# EAGLE design ttag (EAGLE 9.6.2)
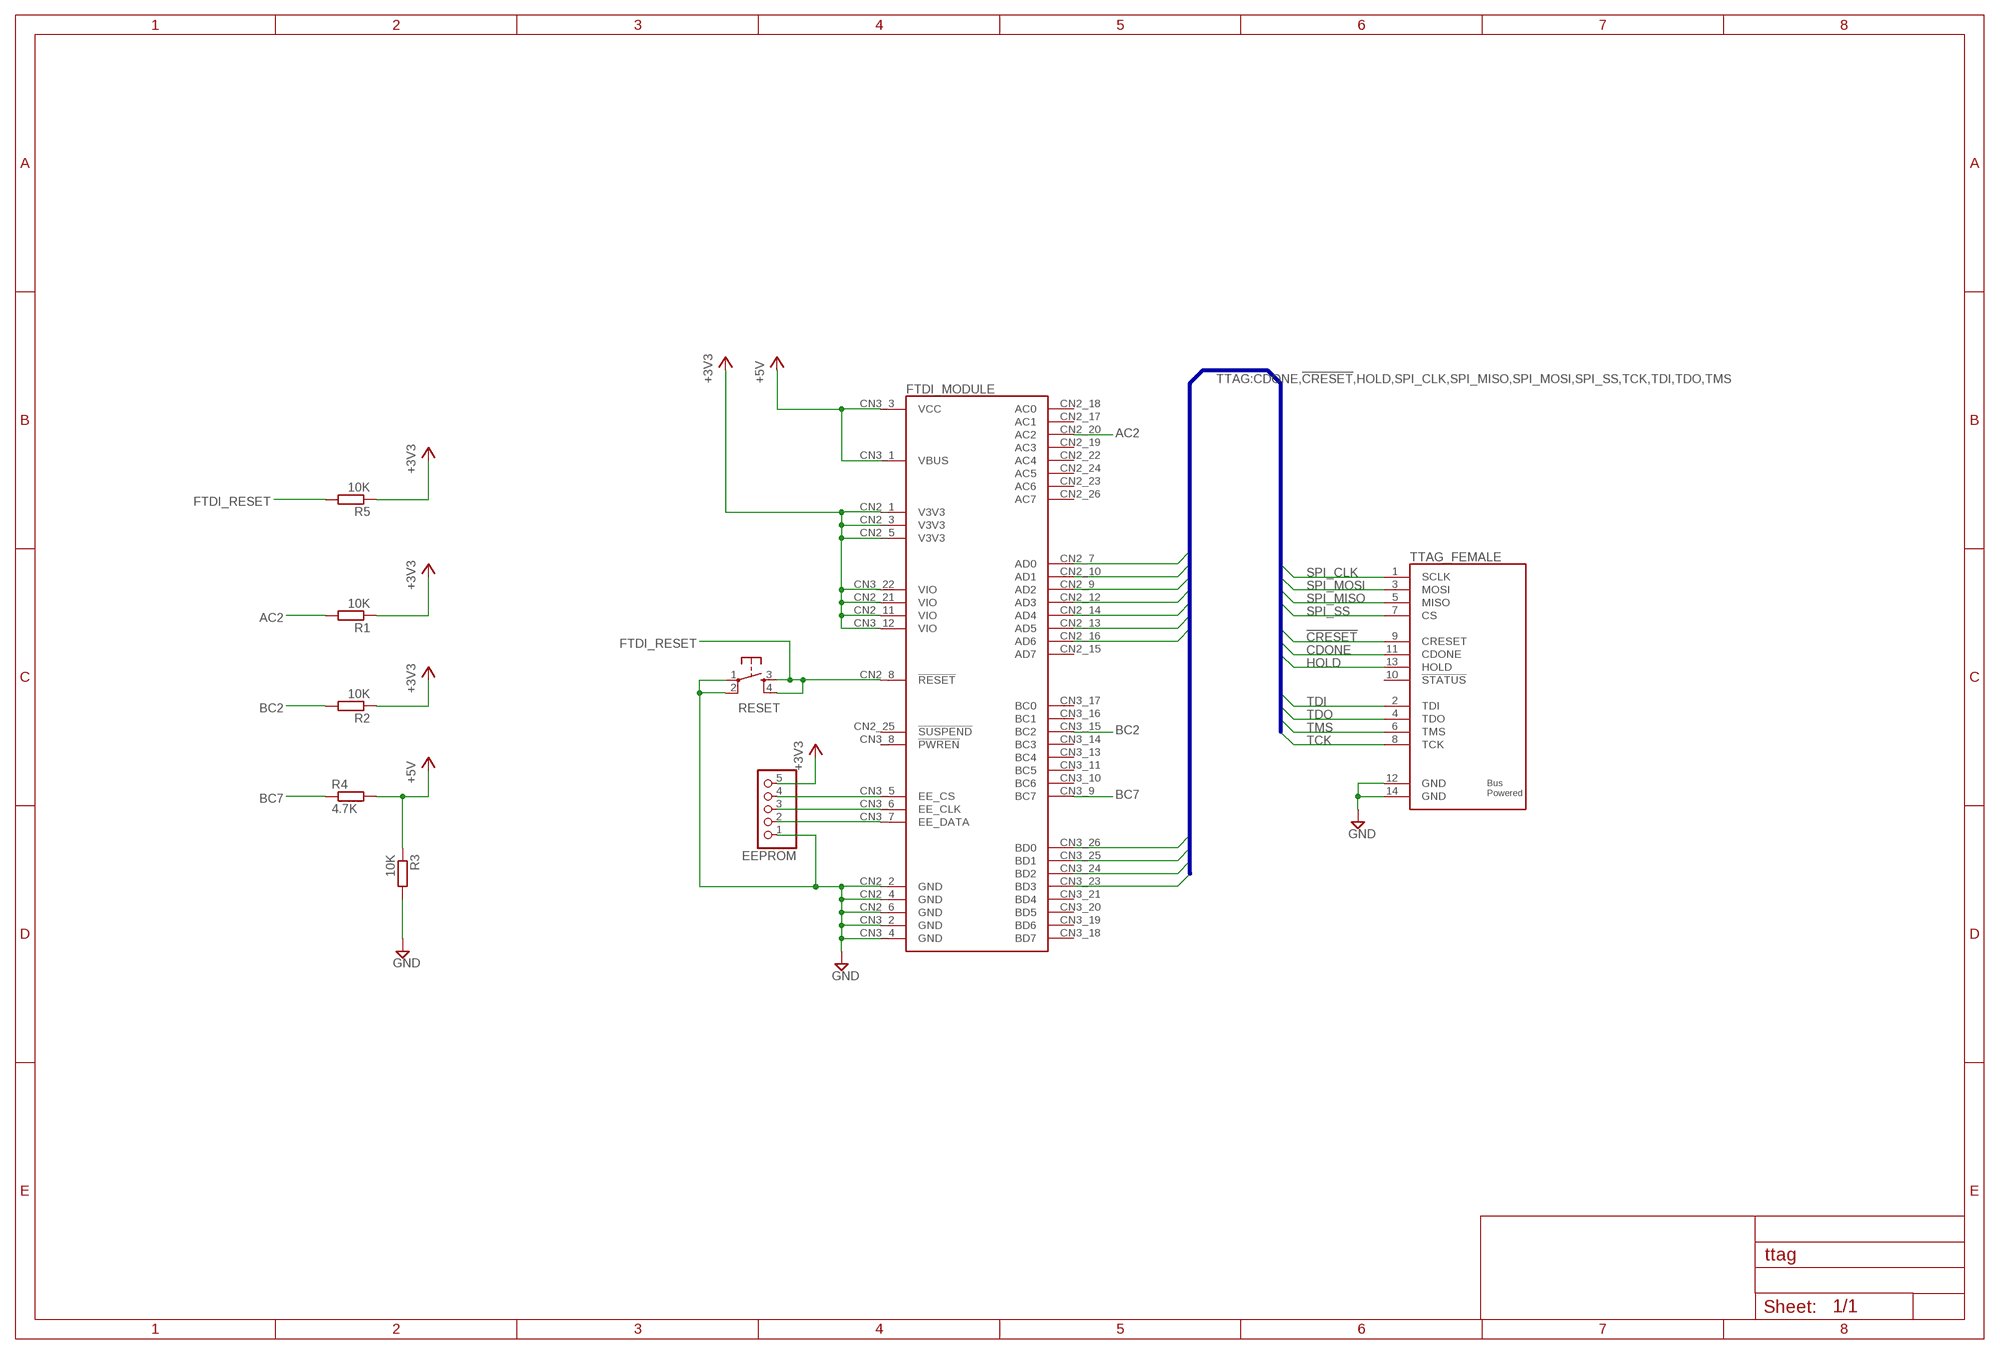
[diagram p0: schematic, sheet 1]

## Parts
EEPROM  PINHD-1X05_2.54  [1X05]
FTDI_MODULE  FTDI_MODULE  [FTDI_MODULE]
R1  10K  R-EU_M1206  [M1206]
R2  10K  R-EU_M1206  [M1206]
R3  10K  R-EU_M1206  [M1206]
R4  4.7K  R-EU_M1206  [M1206]
R5  10K  R-EU_M1206  [M1206]
RESET  TAC_SWITCHPTH  [TACTILE-PTH]
TTAG_FEMALE  TTAG_F  [SFH11PBPCD07RABK]

## Nets
!CRESET!: FTDI_MODULE.CN2_14(AD4) TTAG_FEMALE.9(CRESET)
+3V3: EEPROM.5 FTDI_MODULE.CN2_1(V3V3) FTDI_MODULE.CN2_3(V3V3) FTDI_MODULE.CN2_5(V3V3) FTDI_MODULE.CN2_11(VIO) FTDI_MODULE.CN2_21(VIO) FTDI_MODULE.CN3_12(VIO) FTDI_MODULE.CN3_22(VIO) R1.1 R2.1 R5.1
+5V: FTDI_MODULE.CN3_1(VBUS) FTDI_MODULE.CN3_3(VCC) R3.1 R4.2
AC2: FTDI_MODULE.CN2_20(AC2) R1.2
BC2: FTDI_MODULE.CN3_15(BC2) R2.2
BC7: FTDI_MODULE.CN3_9(BC7) R4.1
CDONE: FTDI_MODULE.CN2_13(AD5) TTAG_FEMALE.11(CDONE)
FTDI_RESET: FTDI_MODULE.CN2_8(!RESET!) R5.2 RESET.3 RESET.4
GND: EEPROM.1 FTDI_MODULE.CN2_2(GND) FTDI_MODULE.CN2_4(GND) FTDI_MODULE.CN2_6(GND) FTDI_MODULE.CN3_2(GND) FTDI_MODULE.CN3_4(GND) R3.2 RESET.1 RESET.2 TTAG_FEMALE.12(GND) TTAG_FEMALE.14(GND)
HOLD: FTDI_MODULE.CN2_16(AD6) TTAG_FEMALE.13(HOLD)
N$1: EEPROM.4 FTDI_MODULE.CN3_5(EE_CS)
N$2: EEPROM.3 FTDI_MODULE.CN3_6(EE_CLK)
N$3: EEPROM.2 FTDI_MODULE.CN3_7(EE_DATA)
SPI_CLK: FTDI_MODULE.CN2_7(AD0) TTAG_FEMALE.1(SCLK)
SPI_MISO: FTDI_MODULE.CN2_9(AD2) TTAG_FEMALE.5(MISO)
SPI_MOSI: FTDI_MODULE.CN2_10(AD1) TTAG_FEMALE.3(MOSI)
SPI_SS: FTDI_MODULE.CN2_12(AD3) TTAG_FEMALE.7(CS)
TCK: FTDI_MODULE.CN3_26(BD0) TTAG_FEMALE.8(TCK)
TDI: FTDI_MODULE.CN3_25(BD1) TTAG_FEMALE.2(TDI)
TDO: FTDI_MODULE.CN3_24(BD2) TTAG_FEMALE.4(TDO)
TMS: FTDI_MODULE.CN3_23(BD3) TTAG_FEMALE.6(TMS)
Unconnected: FTDI_MODULE.CN2_15(AD7) FTDI_MODULE.CN2_17(AC1) FTDI_MODULE.CN2_18(AC0) FTDI_MODULE.CN2_19(AC3) FTDI_MODULE.CN2_22(AC4) FTDI_MODULE.CN2_23(AC6) FTDI_MODULE.CN2_24(AC5) FTDI_MODULE.CN2_25(!SUSPEND!) FTDI_MODULE.CN2_26(AC7) FTDI_MODULE.CN3_8(!PWREN!) FTDI_MODULE.CN3_10(BC6) FTDI_MODULE.CN3_11(BC5) FTDI_MODULE.CN3_13(BC4) FTDI_MODULE.CN3_14(BC3) FTDI_MODULE.CN3_16(BC1) FTDI_MODULE.CN3_17(BC0) FTDI_MODULE.CN3_18(BD7) FTDI_MODULE.CN3_19(BD6) FTDI_MODULE.CN3_20(BD5) FTDI_MODULE.CN3_21(BD4) TTAG_FEMALE.10(!STATUS!)

## Buses
TTAG:CDONE,!CRESET!,HOLD,SPI_CLK,SPI_MISO,SPI_MOSI,SPI_SS,TCK,TDI,TDO,TMS

## Library data of the parts
EEPROM = pinhead-2:PINHD-1X05: PIN HEADER
FTDI_MODULE = ttag:FTDI_MODULE
R1-R5 = rcl:R-EU_: RESISTOR, European symbol; SPICEPREFIX: R
RESET = SparkFun:TAC_SWITCH: Momentary Switch Button commonly used for reset or general input. Spark Fun Electronics SKU : COM-00097; DNF: 1; USE: B3F-1005
TTAG_FEMALE = x-pi:TTAG_F: CONN HDR 14POS 0.1 GOLD PCB R/A Source: Datasheet <https://s3.amazonaws.com/catalogspreads-pdf/PAGE123 .100 SFH11 SERIES FEMALE HDR ST RA.pdf>; DESCRIPTION: CONN HDR 14POS 0.1 GOLD PCB R/A; HEIGHT: 6mm; MANUFACTURER_NAME: Sullins; MANUFACTURER_PART_NUMBER: SFH11-PBPC-D07-RA-BK

## Board
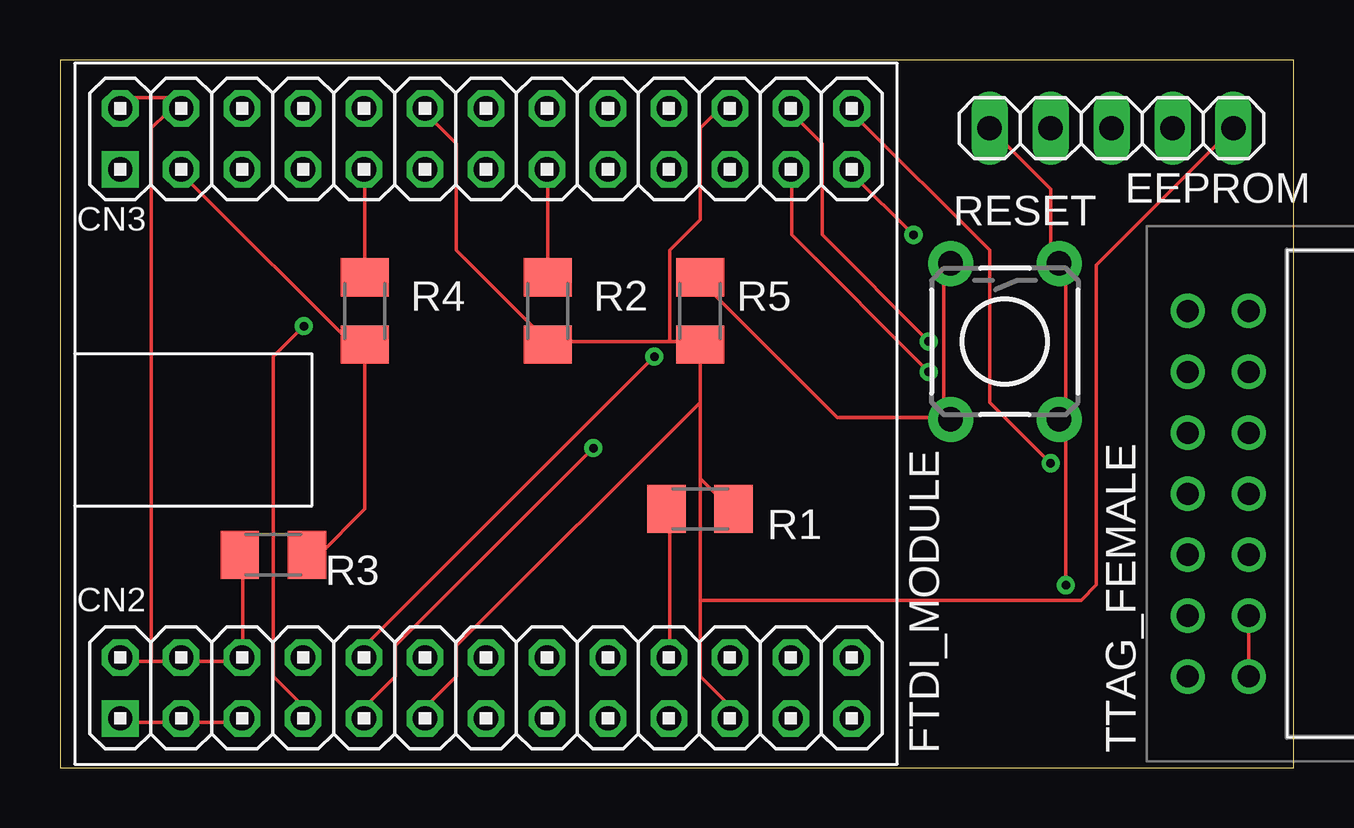
[diagram p1: board, top side]
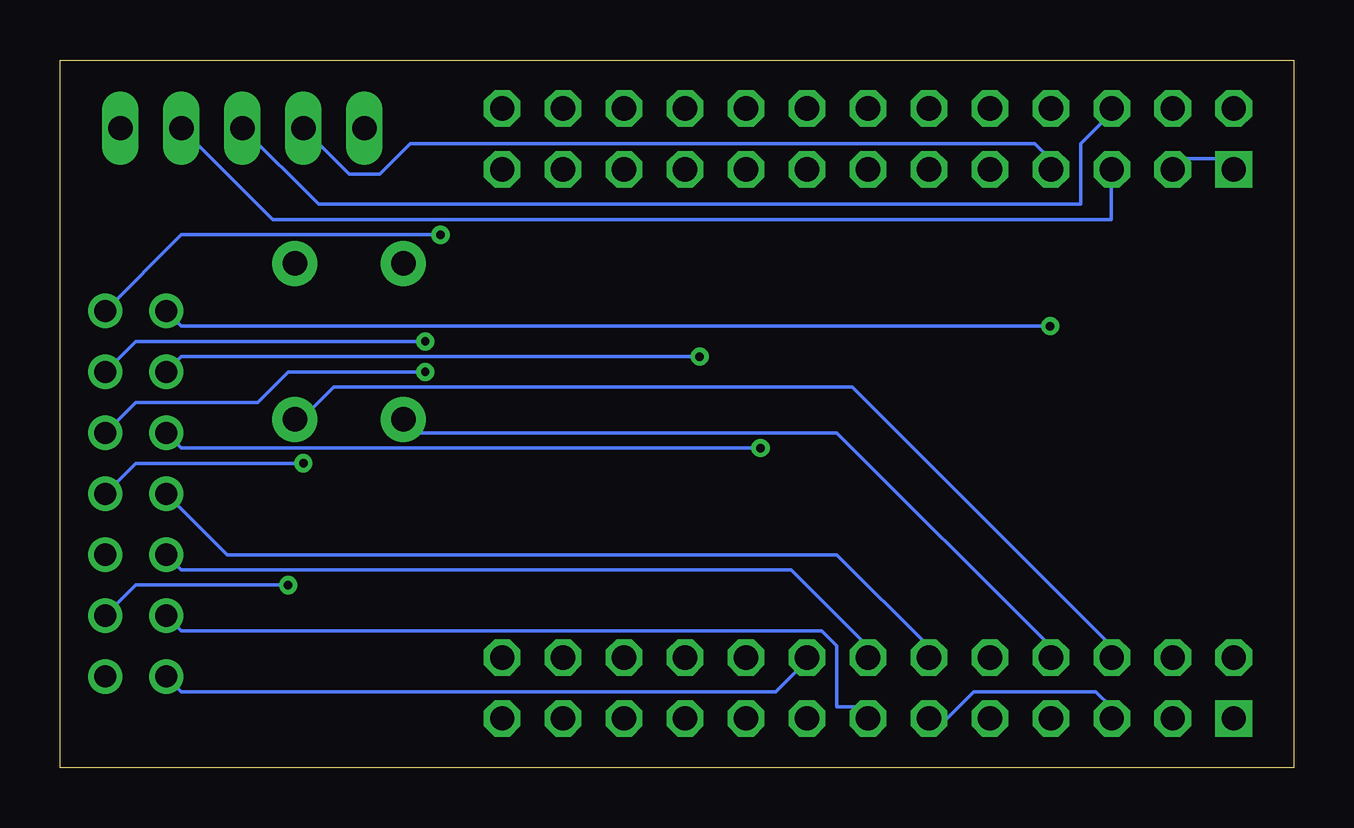
[diagram p2: board, bottom side, seen from below]

Size 51.41 x 29.52 mm. Coordinates in mm from the lower left corner, seen from the top.
Outline: 0,0 51.41,0 51.41,29.52 0,29.52 0,0
Copper layers (1*16): Top 0.035mm / dielectric 1.5mm / Bottom 0.035mm
Design rules "default": minimum track width 6mil, minimum drill 0.35mm, track to track 6mil, track to pad 6mil, pad to pad 6mil, via to via 6mil, smd to smd 6mil, copper to edge 40mil, drill to drill 6mil, minimum pad ring 10mil, minimum via ring 8mil, stop-mask expansion 4mil, vias tented up to drill 0mil, thermal gap 10mil

### Footprints (pad centres in the part's own frame; a part is rotated, then mirrored left to right if it is on the bottom)
1X05 = drill 1.016 long: 1 -5.08,0; 2 -2.54,0; 3 0,0; 4 2.54,0; 5 5.08,0
FTDI_MODULE = drill 1.016 square: CN2_1 -14,-12.54; CN3_1 -14,10.35 | drill 1.016 octagon: CN2_2 -14,-10; CN2_3 -11.46,-12.54; CN2_4 -11.46,-10; CN2_5 -8.92,-12.54; CN2_6 -8.92,-10; CN2_7 -6.38,-12.54; CN2_8 -6.38,-10; CN2_9 -3.84,-12.54; CN2_10 -3.84,-10; CN2_11 -1.3,-12.54; CN2_12 -1.3,-10; CN2_13 1.24,-12.54; CN2_14 1.24,-10; CN2_15 3.78,-12.54; CN2_16 3.78,-10; CN2_17 6.32,-12.54; CN2_18 6.32,-10; CN2_19 8.86,-12.54; CN2_20 8.86,-10; CN2_21 11.4,-12.54; CN2_22 11.4,-10; CN2_23 13.94,-12.54; CN2_24 13.94,-10; CN2_25 16.48,-12.54; CN2_26 16.48,-10; CN3_2 -14,12.89; CN3_3 -11.46,10.35; CN3_4 -11.46,12.89; CN3_5 -8.92,10.35; CN3_6 -8.92,12.89; CN3_7 -6.38,10.35; CN3_8 -6.38,12.89; CN3_9 -3.84,10.35; CN3_10 -3.84,12.89; CN3_11 -1.3,10.35; CN3_12 -1.3,12.89; CN3_13 1.24,10.35; CN3_14 1.24,12.89; CN3_15 3.78,10.35; CN3_16 3.78,12.89; CN3_17 6.32,10.35; CN3_18 6.32,12.89; CN3_19 8.86,10.35; CN3_20 8.86,12.89; CN3_21 11.4,10.35; CN3_22 11.4,12.89; CN3_23 13.94,10.35; CN3_24 13.94,12.89; CN3_25 16.48,10.35; CN3_26 16.48,12.89
M1206 = smd 1.6 x 2: 1 -1.4,0; 2 1.4,0
TACTILE-PTH = drill 1.016 pad 1.88: 1 -3.251,2.261; 2 3.251,2.261; 3 -3.251,-2.261; 4 3.251,-2.261
SFH11PBPCD07RABK = drill 0.92 pad 1.431: 1 0,0; 2 0,2.54; 3 2.54,0; 4 2.54,2.54; 5 5.08,0; 6 5.08,2.54; 7 7.62,0; 8 7.62,2.54; 9 10.16,0; 10 10.16,2.54; 11 12.7,0; 12 12.7,2.54; 13 15.24,0; 14 15.24,2.54

### Placement (x,y rotation side)
EEPROM  43.81,26.67 0 top
FTDI_MODULE  16.51,14.61 0 top
R1  26.67,10.79 180 top
R2  20.32,19.05 90 top
R3  8.89,8.89 180 top
R4  12.7,19.05 270 top
R5  26.67,19.05 90 top
RESET  39.37,17.78 270 top
TTAG_FEMALE  46.99,19.05 270 top

### Tracks (layer width: path | path; a pad name or v marks a point on that pad's centre or on a via)
!CRESET!
  Bottom 0.152: TTAG_FEMALE.9 46.35,8.26 20.95,8.26 17.78,5.08 FTDI_MODULE.CN2_14
+3V3
  Top 0.152: FTDI_MODULE.CN2_1 2.54,1.91 4.45,1.91 FTDI_MODULE.CN2_3 5.08,1.91 6.99,1.91 FTDI_MODULE.CN2_5 | 25.4,17.78 26.67,17.78 R5.1 26.67,15.24 | 25.4,17.78 20.32,17.78 | 26.67,12.06 27.94,10.79 R1.1 | 26.67,15.24 26.67,12.06 | 26.67,12.06 26.67,6.99 | 26.67,6.99 26.67,3.81 27.94,2.54 FTDI_MODULE.CN2_21 | EEPROM.5 43.18,20.95 43.18,7.62 42.55,6.99 26.67,6.99 | 20.32,17.78 16.51,21.59 16.51,26.04 15.24,27.3 FTDI_MODULE.CN3_12 | 20.32,17.78 R2.1 | 25.4,17.78 25.4,21.59 26.67,22.86 26.67,26.67 27.3,27.3 FTDI_MODULE.CN3_22 | 26.67,15.24 16.51,5.08 16.51,3.81 15.24,2.54 FTDI_MODULE.CN2_11
  Bottom 0.152: FTDI_MODULE.CN2_11 14.61,1.91 13.34,3.17 8.26,3.17 7.62,2.54 FTDI_MODULE.CN2_5
+5V
  Top 0.152: 12.7,17.14 12.7,10.79 10.79,8.89 R3.1 | 12.7,17.14 5.08,24.77 FTDI_MODULE.CN3_3 | 12.7,17.14 R4.2
  Bottom 0.152: FTDI_MODULE.CN3_1 2.54,25.4 4.45,25.4 FTDI_MODULE.CN3_3
AC2
  Top 0.152: R1.2 25.4,10.79 25.4,5.08 FTDI_MODULE.CN2_20
BC2
  Top 0.152: R2.2 20.32,24.77 FTDI_MODULE.CN3_15
BC7
  Top 0.152: R4.1 12.7,24.77 FTDI_MODULE.CN3_9
CDONE
  Bottom 0.152: TTAG_FEMALE.11 46.35,5.71 19.68,5.71 19.05,5.08 19.05,2.54 17.78,2.54 FTDI_MODULE.CN2_13
FTDI_RESET
  Top 0.152: 36.83,14.61 32.38,14.61 26.67,20.32 R5.2 | 36.83,14.61 36.83,20.95 RESET.3 | 36.83,14.61 RESET.4
  Bottom 0.152: FTDI_MODULE.CN2_8 10.16,5.08 19.05,13.97 36.83,13.97 RESET.4
GND  (via drill 0.35)
  Top 0.152: FTDI_MODULE.CN3_2 2.54,27.94 4.45,27.94 FTDI_MODULE.CN3_4 4.45,27.3 3.81,26.67 3.81,4.45 | 3.81,4.45 4.45,4.45 FTDI_MODULE.CN2_4 5.08,4.45 6.99,4.45 FTDI_MODULE.CN2_6 7.62,5.08 7.62,8.89 R3.2 | 3.81,4.45 2.54,4.45 FTDI_MODULE.CN2_2 | EEPROM.1 41.27,24.13 41.27,21.59 RESET.1 41.91,20.95 41.91,14.61 RESET.2 41.91,13.97 v41.91,7.62 | TTAG_FEMALE.12 TTAG_FEMALE.14
  Bottom 0.152: TTAG_FEMALE.12 48.26,7.62 v41.91,7.62 | FTDI_MODULE.CN2_6 7.62,5.08 18.41,15.88 40.01,15.88 41.27,14.61 RESET.2
HOLD
  Bottom 0.152: TTAG_FEMALE.13 46.35,3.17 21.59,3.17 20.32,4.45 FTDI_MODULE.CN2_16
N$1
  Bottom 0.152: EEPROM.4 42.55,22.86 7.62,22.86 7.62,24.77 FTDI_MODULE.CN3_5
N$2
  Bottom 0.152: EEPROM.3 40.64,23.5 8.89,23.5 8.89,26.04 7.62,27.3 FTDI_MODULE.CN3_6
N$3
  Bottom 0.152: EEPROM.2 39.37,24.77 38.1,24.77 36.83,26.04 10.79,26.04 10.16,25.4 FTDI_MODULE.CN3_7
SPI_CLK  (via drill 0.35)
  Top 0.152: v10.16,18.41 8.89,17.14 8.89,3.81 10.16,2.54 FTDI_MODULE.CN2_7
  Bottom 0.152: TTAG_FEMALE.1 46.35,18.41 v10.16,18.41
SPI_MISO  (via drill 0.35)
  Top 0.152: v22.23,13.34 13.97,5.08 13.97,3.81 12.7,2.54 FTDI_MODULE.CN2_9
  Bottom 0.152: TTAG_FEMALE.5 46.35,13.34 v22.23,13.34
SPI_MOSI  (via drill 0.35)
  Top 0.152: v24.77,17.14 12.7,5.08 FTDI_MODULE.CN2_10
  Bottom 0.152: TTAG_FEMALE.3 46.35,17.14 v24.77,17.14
SPI_SS
  Bottom 0.152: TTAG_FEMALE.7 44.45,8.89 19.05,8.89 15.24,5.08 FTDI_MODULE.CN2_12
TCK  (via drill 0.35)
  Top 0.152: v41.27,12.7 38.73,15.24 38.73,21.59 33.02,27.3 FTDI_MODULE.CN3_26
  Bottom 0.152: TTAG_FEMALE.8 48.26,12.7 v41.27,12.7
TDI  (via drill 0.35)
  Top 0.152: v35.56,22.23 33.02,24.77 FTDI_MODULE.CN3_25
  Bottom 0.152: TTAG_FEMALE.2 46.35,22.23 v35.56,22.23
TDO  (via drill 0.35)
  Top 0.152: v36.2,17.78 31.75,22.23 31.75,26.04 30.48,27.3 FTDI_MODULE.CN3_24
  Bottom 0.152: TTAG_FEMALE.4 48.26,17.78 v36.2,17.78
TMS  (via drill 0.35)
  Top 0.152: v36.2,16.51 30.48,22.23 30.48,24.77 FTDI_MODULE.CN3_23
  Bottom 0.152: TTAG_FEMALE.6 48.26,15.24 43.18,15.24 41.91,16.51 v36.2,16.51